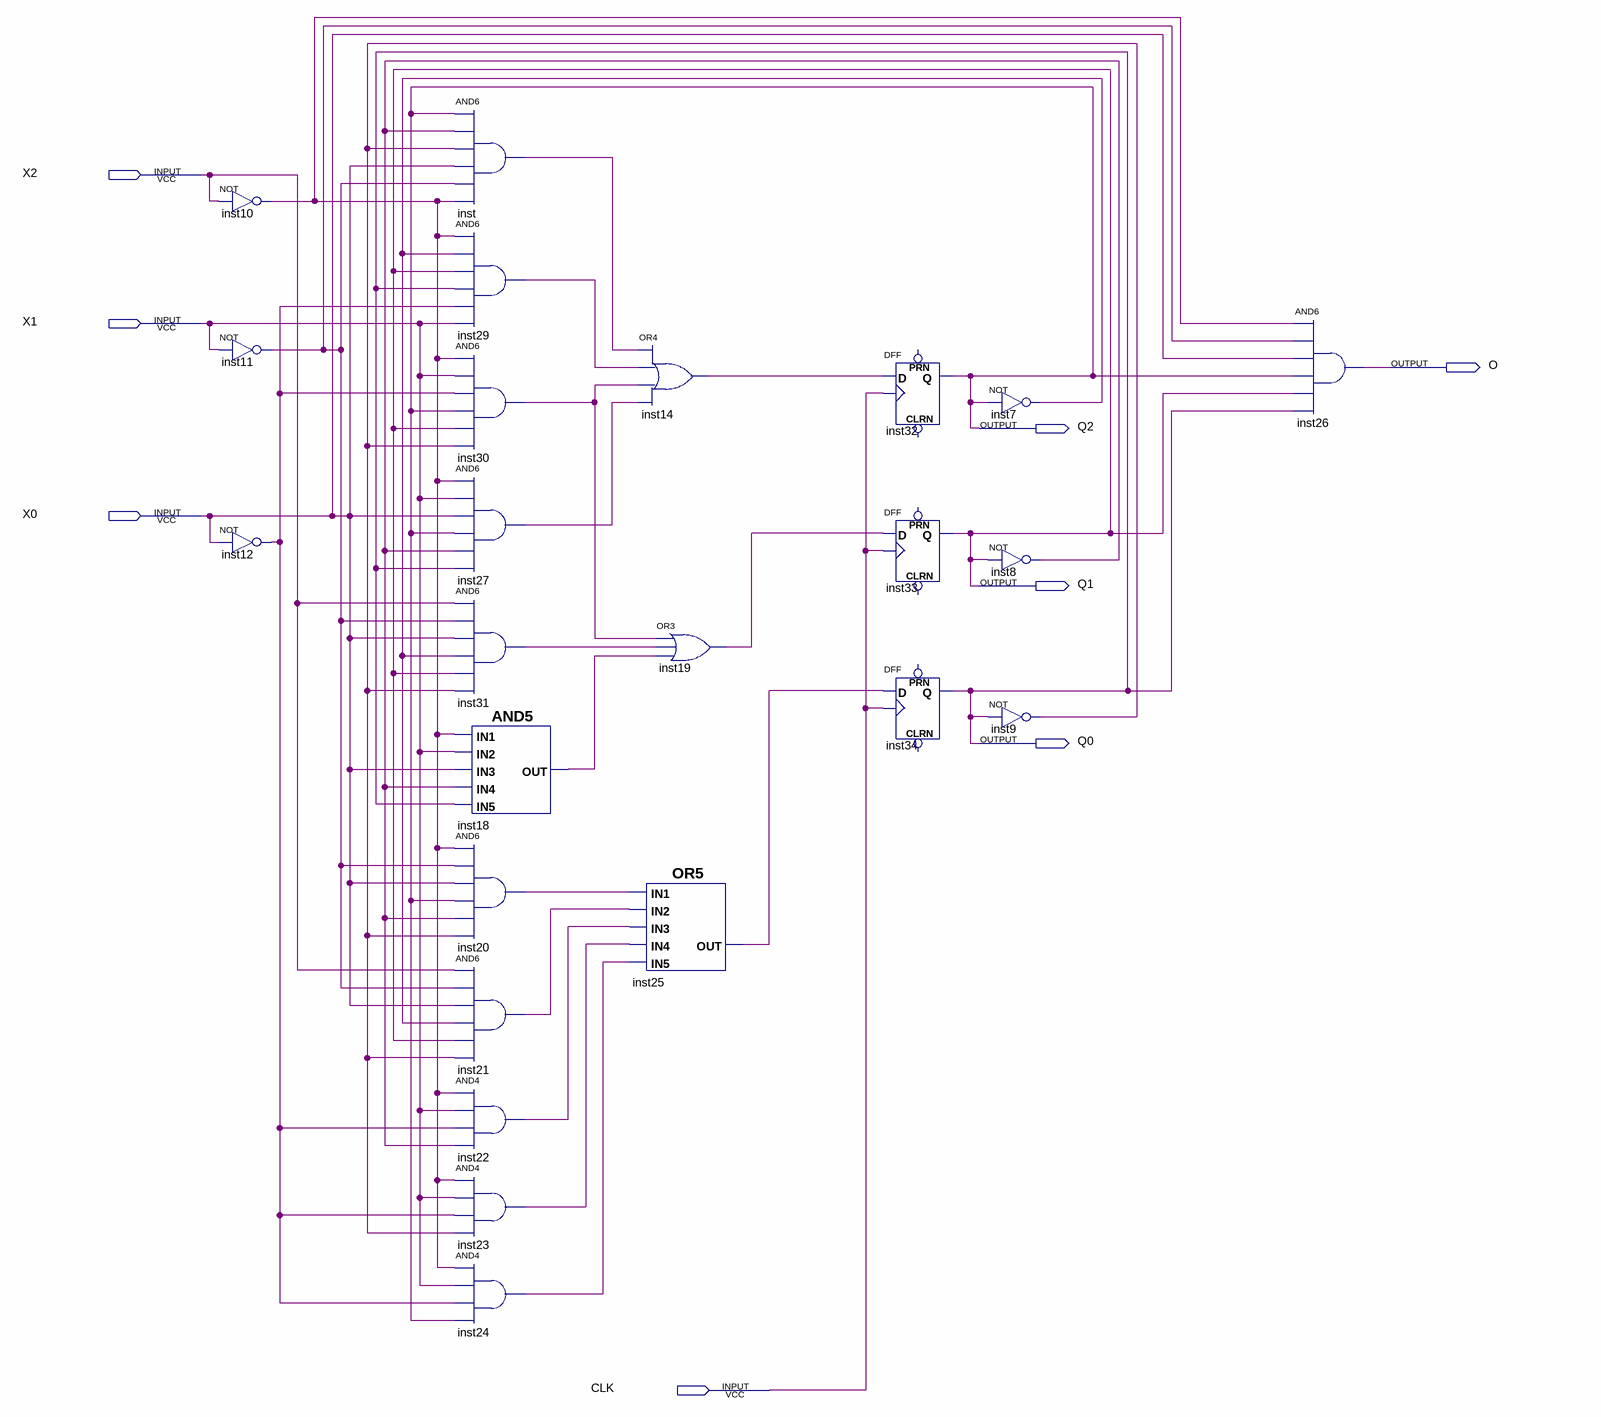
[diagram p0: schematic sheet]
// Quartus schematic Lab2_Bonus.bdf as structural Verilog: 24 symbols, 8 pins
module Lab2_Bonus (
  input  X2,
  input  X1,
  input  X0,
  input  CLK,
  output O,
  output Q2,
  output Q1,
  output Q0
);

  wire inst7_out, inst8_out, inst9_out, inst10_out, inst11_out, inst12_out, inst14_out, inst18_out,
       inst19_out, inst20_out, inst21_out, inst22_out, inst23_out, inst24_out, inst25_out, inst27_out,
       inst29_out, inst30_out, inst31_out, inst_out;

  not inst10 (inst10_out, X2);
  not inst11 (inst11_out, X1);
  not inst12 (inst12_out, X0);
  and inst (inst_out, Q2, inst8_out, inst9_out, X0, inst11_out, inst10_out);
  and inst29 (inst29_out, inst10_out, inst7_out, Q1, Q0, inst12_out, X1);
  and inst30 (inst30_out, inst10_out, X1, inst12_out, Q2, Q1, inst9_out);
  and inst27 (inst27_out, inst10_out, X1, X0, Q2, inst8_out, Q0);
  and inst31 (inst31_out, X2, inst11_out, X0, inst7_out, Q1, inst9_out);
  and inst18 (inst18_out, inst10_out, X1, X0, inst8_out, Q0);
  and inst20 (inst20_out, inst10_out, inst11_out, X0, Q2, inst8_out, inst9_out);
  and inst21 (inst21_out, X2, inst11_out, X0, inst7_out, Q1, inst9_out);
  and inst22 (inst22_out, inst10_out, X1, inst12_out, inst8_out);
  and inst23 (inst23_out, inst10_out, X1, inst12_out, inst9_out);
  and inst24 (inst24_out, inst10_out, X1, inst12_out, Q2);
  or inst14 (inst14_out, inst_out, inst29_out, inst30_out, inst27_out);
  or inst25 (inst25_out, inst20_out, inst21_out, inst22_out, inst23_out, inst24_out);
  or inst19 (inst19_out, inst30_out, inst31_out, inst18_out);
  DFF inst32 (.CLK(CLK), .D(inst14_out), .Q(Q2));  // open: CLRN, PRN
  DFF inst33 (.CLK(CLK), .D(inst19_out), .Q(Q1));  // open: CLRN, PRN
  DFF inst34 (.CLK(CLK), .D(inst25_out), .Q(Q0));  // open: CLRN, PRN
  not inst7 (inst7_out, Q2);
  not inst8 (inst8_out, Q1);
  not inst9 (inst9_out, Q0);
  and inst26 (O, inst10_out, inst11_out, X0, Q2, Q1, Q0);
endmodule
